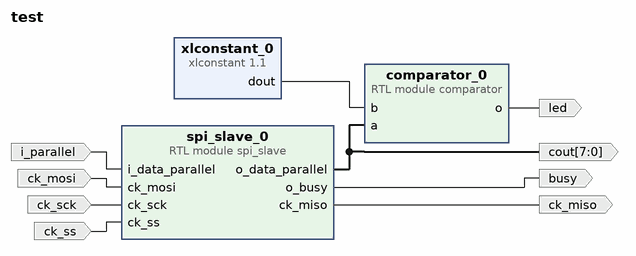
[diagram p0: block diagram of the top level]
# Vivado block design test, xc7z020clg400-1, Vivado 2023.2
create_bd_design test

create_bd_port -dir O led
create_bd_port -dir I ck_sck
create_bd_port -dir I ck_ss
create_bd_port -dir I ck_mosi
create_bd_port -dir O ck_miso
create_bd_port -dir O -from 7 -to 0 -type data cout
create_bd_port -dir O busy
create_bd_port -dir I i_parallel

create_bd_cell -type module -reference spi_slave spi_slave_0
create_bd_cell -type module -reference comparator comparator_0
create_bd_cell -type ip -vlnv xilinx.com:ip:xlconstant:1.1 xlconstant_0
set_property -dict {CONFIG.CONST_WIDTH 8} [get_bd_cells xlconstant_0]

# ---- connections ----

connect_bd_net [get_bd_pins comparator_0/o] [get_bd_ports led]
connect_bd_net [get_bd_ports i_parallel] [get_bd_pins spi_slave_0/i_data_parallel]
connect_bd_net -net mosi_1 [get_bd_ports ck_mosi] [get_bd_pins spi_slave_0/ck_mosi]
connect_bd_net -net sck_1 [get_bd_ports ck_sck] [get_bd_pins spi_slave_0/ck_sck]
connect_bd_net [get_bd_pins spi_slave_0/ck_miso] [get_bd_ports ck_miso]
connect_bd_net [get_bd_pins spi_slave_0/o_busy] [get_bd_ports busy]
connect_bd_net [get_bd_pins spi_slave_0/o_data_parallel] [get_bd_ports cout] [get_bd_pins comparator_0/a]
connect_bd_net -net ss_1 [get_bd_ports ck_ss] [get_bd_pins spi_slave_0/ck_ss]
connect_bd_net [get_bd_pins xlconstant_0/dout] [get_bd_pins comparator_0/b]

validate_bd_design
save_bd_design
